# EAGLE schematic eeZee_microSD (EAGLE 6.4)
DATABASE: ./../../../eagle/PARTSDB.TXT
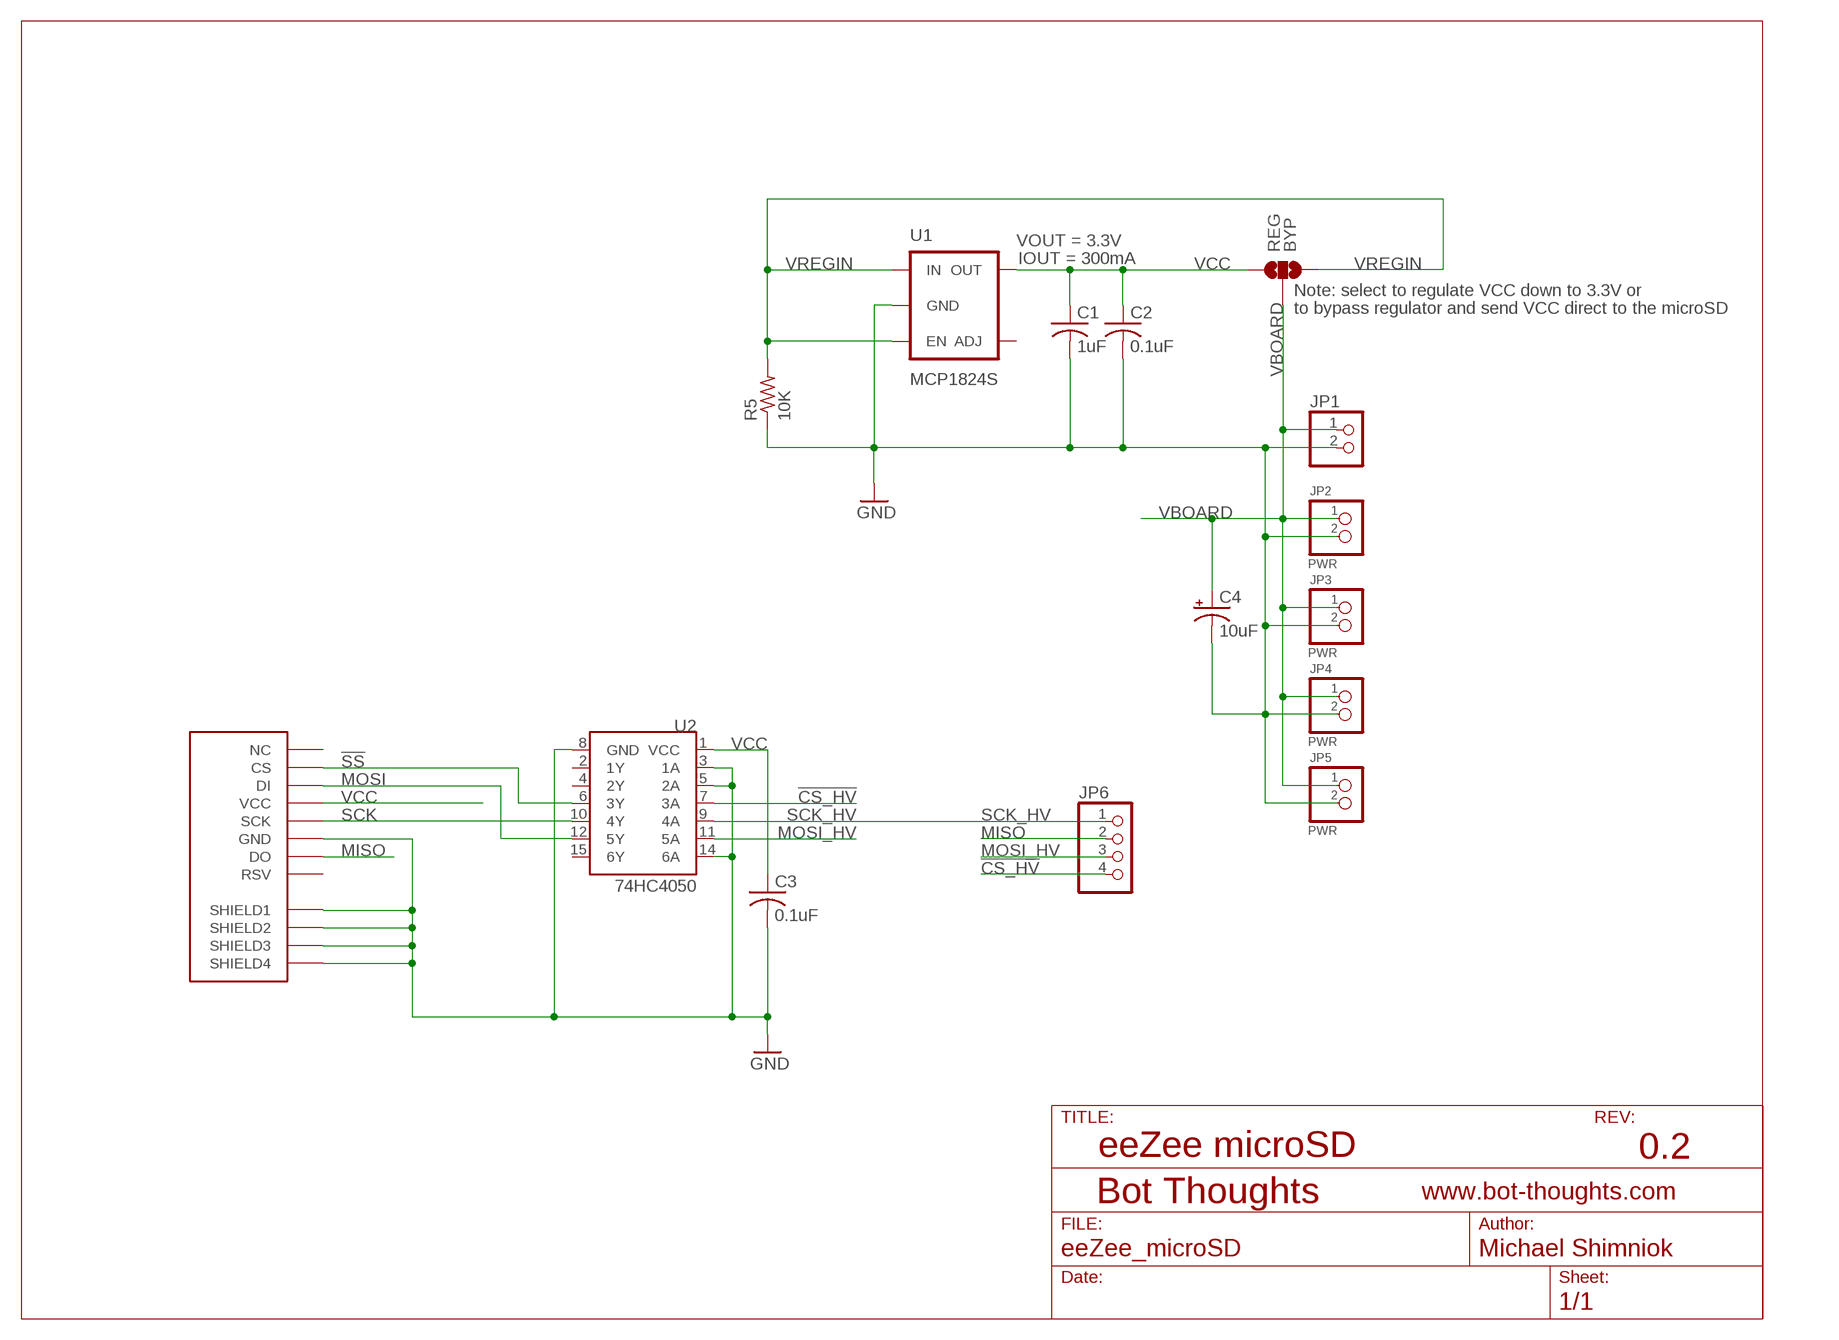
[diagram p0: schematic, sheet 1]

## Parts
C1  1uF  C-USC0603  [C0603]
C2  0.1uF  C-USC0603  [C0603]
C3  0.1uF  C-USC0603  [C0603]
C4  10uF  CPOL-USSMCB  [SMC_B]
JP1  PINHD-1X02_2.54-S  [1X02-S]
JP2  PWR  PINHEAD-2BIG  [BIGPIN-2]
JP3  PWR  PINHEAD-2BIG  [BIGPIN-2]
JP4  PWR  PINHEAD-2BIG  [BIGPIN-2]
JP5  PWR  PINHEAD-2BIG  [BIGPIN-2]
JP6  PINHD-1X04_2.54-S  [1X04-S]
R5  10K  R-US_R0603  [R0603]
REG  BYP  SOLDERJUMPER_2WAYS  [SJ_3]
U1  MCP1824S  MCP1824  [SOT23-5]
U2  74HC4050  HEX_CONVERTER  [SO016]
U$1  MICROSD_TFLASH  [TFLASH_CP-0000-086]

## Nets
!CS_HV: JP6.4 U2.7(3A)
!SS: U2.6(3Y) U$1.CS
GND: C1.2 C2.2 C3.2 C4.- JP1.2 JP2.P$2 JP3.P$2 JP4.P$2 JP5.P$2 R5.1 U1.2(GND) U2.3(1A) U2.5(2A) U2.8(GND) U2.14(6A) U$1.GND U$1.SHIELD1 U$1.SHIELD2 U$1.SHIELD3 U$1.SHIELD4
MISO: JP6.2 U$1.DO
MOSI: U2.12(5Y) U$1.DI
MOSI_HV: JP6.3 U2.11(5A)
SCK: U2.10(4Y) U$1.SCLK(SCK)
SCK_HV: JP6.1 U2.9(4A)
VBOARD: C4.+ JP1.1 JP2.P$1 JP3.P$1 JP4.P$1 JP5.P$1 REG.2
VCC: C1.1 C2.1 C3.1 REG.1 U1.5(OUT) U2.1(VCC) U$1.VDD(VCC)
VREGIN: R5.2 REG.3 U1.1(IN) U1.3(EN)
Unconnected: U1.4(ADJ) U2.2(1Y) U2.4(2Y) U2.15(6Y) U$1.NC U$1.RSV

## Notes on the sheet
- Note: select to regulate VCC down to 3.3V or
- to bypass regulator and send VCC direct to the microSD
- eeZee microSD | 0.2

## Library data of the parts
C1-C3 = rcl:C-US: CAPACITOR, American symbol; PARTNO: LMK107B7105KA-T
C4 = rcl:CPOL-US: POLARIZED CAPACITOR, American symbol; PARTNO: LMK107B7105KA-T
JP1 = pinhead-2:PINHD-1X02: PIN HEADER
JP2-JP5 = mes_electromech:PINHEAD-2: Pin header (pinheader) x 2
JP6 = pinhead-2:PINHD-1X04: PIN HEADER
R5 = rcl:R-US_: RESISTOR, American symbol; PARTNO: ERJ-3GEYJ103V
REG = SparkFun:SOLDERJUMPER_2WAY: Solder Jumper 2 way solder jumper
U1 = mes_regulators:MCP1824: MCP1824 LDO voltage regulator The MCP1824/MCP1824S is a 300 mA Low Dropout (LDO) linear regulator that provides high current and low output voltages. The MCP1824 comes in a fixed or adjustable output voltage version, with an output voltage range of 0.8V to 5.0V. Datasheet.pdf <http://ww1.microchip.com/downloads/en/devicedoc/22070a.pdf>; IOUT: 300mA; PARTNO: MCP1824ST-3302E/DB; VOUT: 3.3V
U2 = SparkFun:HEX_CONVERTER
U$1 = mes_electromech:MICROSD: MicroSD Card Socket